# Altium schematic sheet Hvamp32_Supply.SchDoc: HVAMP_32
size 420 x 297 mm; EDA_Number: ARTIQ; Projet: Zotino; Author: G.Kasprowicz; CompanyName: WUT ISE; DrawnBy: G.Kasprowicz; Organization: WUT ISE; Address1: PW ISE; Address2: Nowowiejska 15/19 00-665 Warsaw; Address3: gkasprow@gmail.com; DocumentNumber: 3; Revision: 2; SheetNumber: 3; SheetTotal: 3; ModifiedBy: -; CheckedDate: -; Title2: Power Supply; DivGrp: WUT ISE; Designer: G.Kasprowicz; ModifiedDate: -; ProjectName: Sensor Box
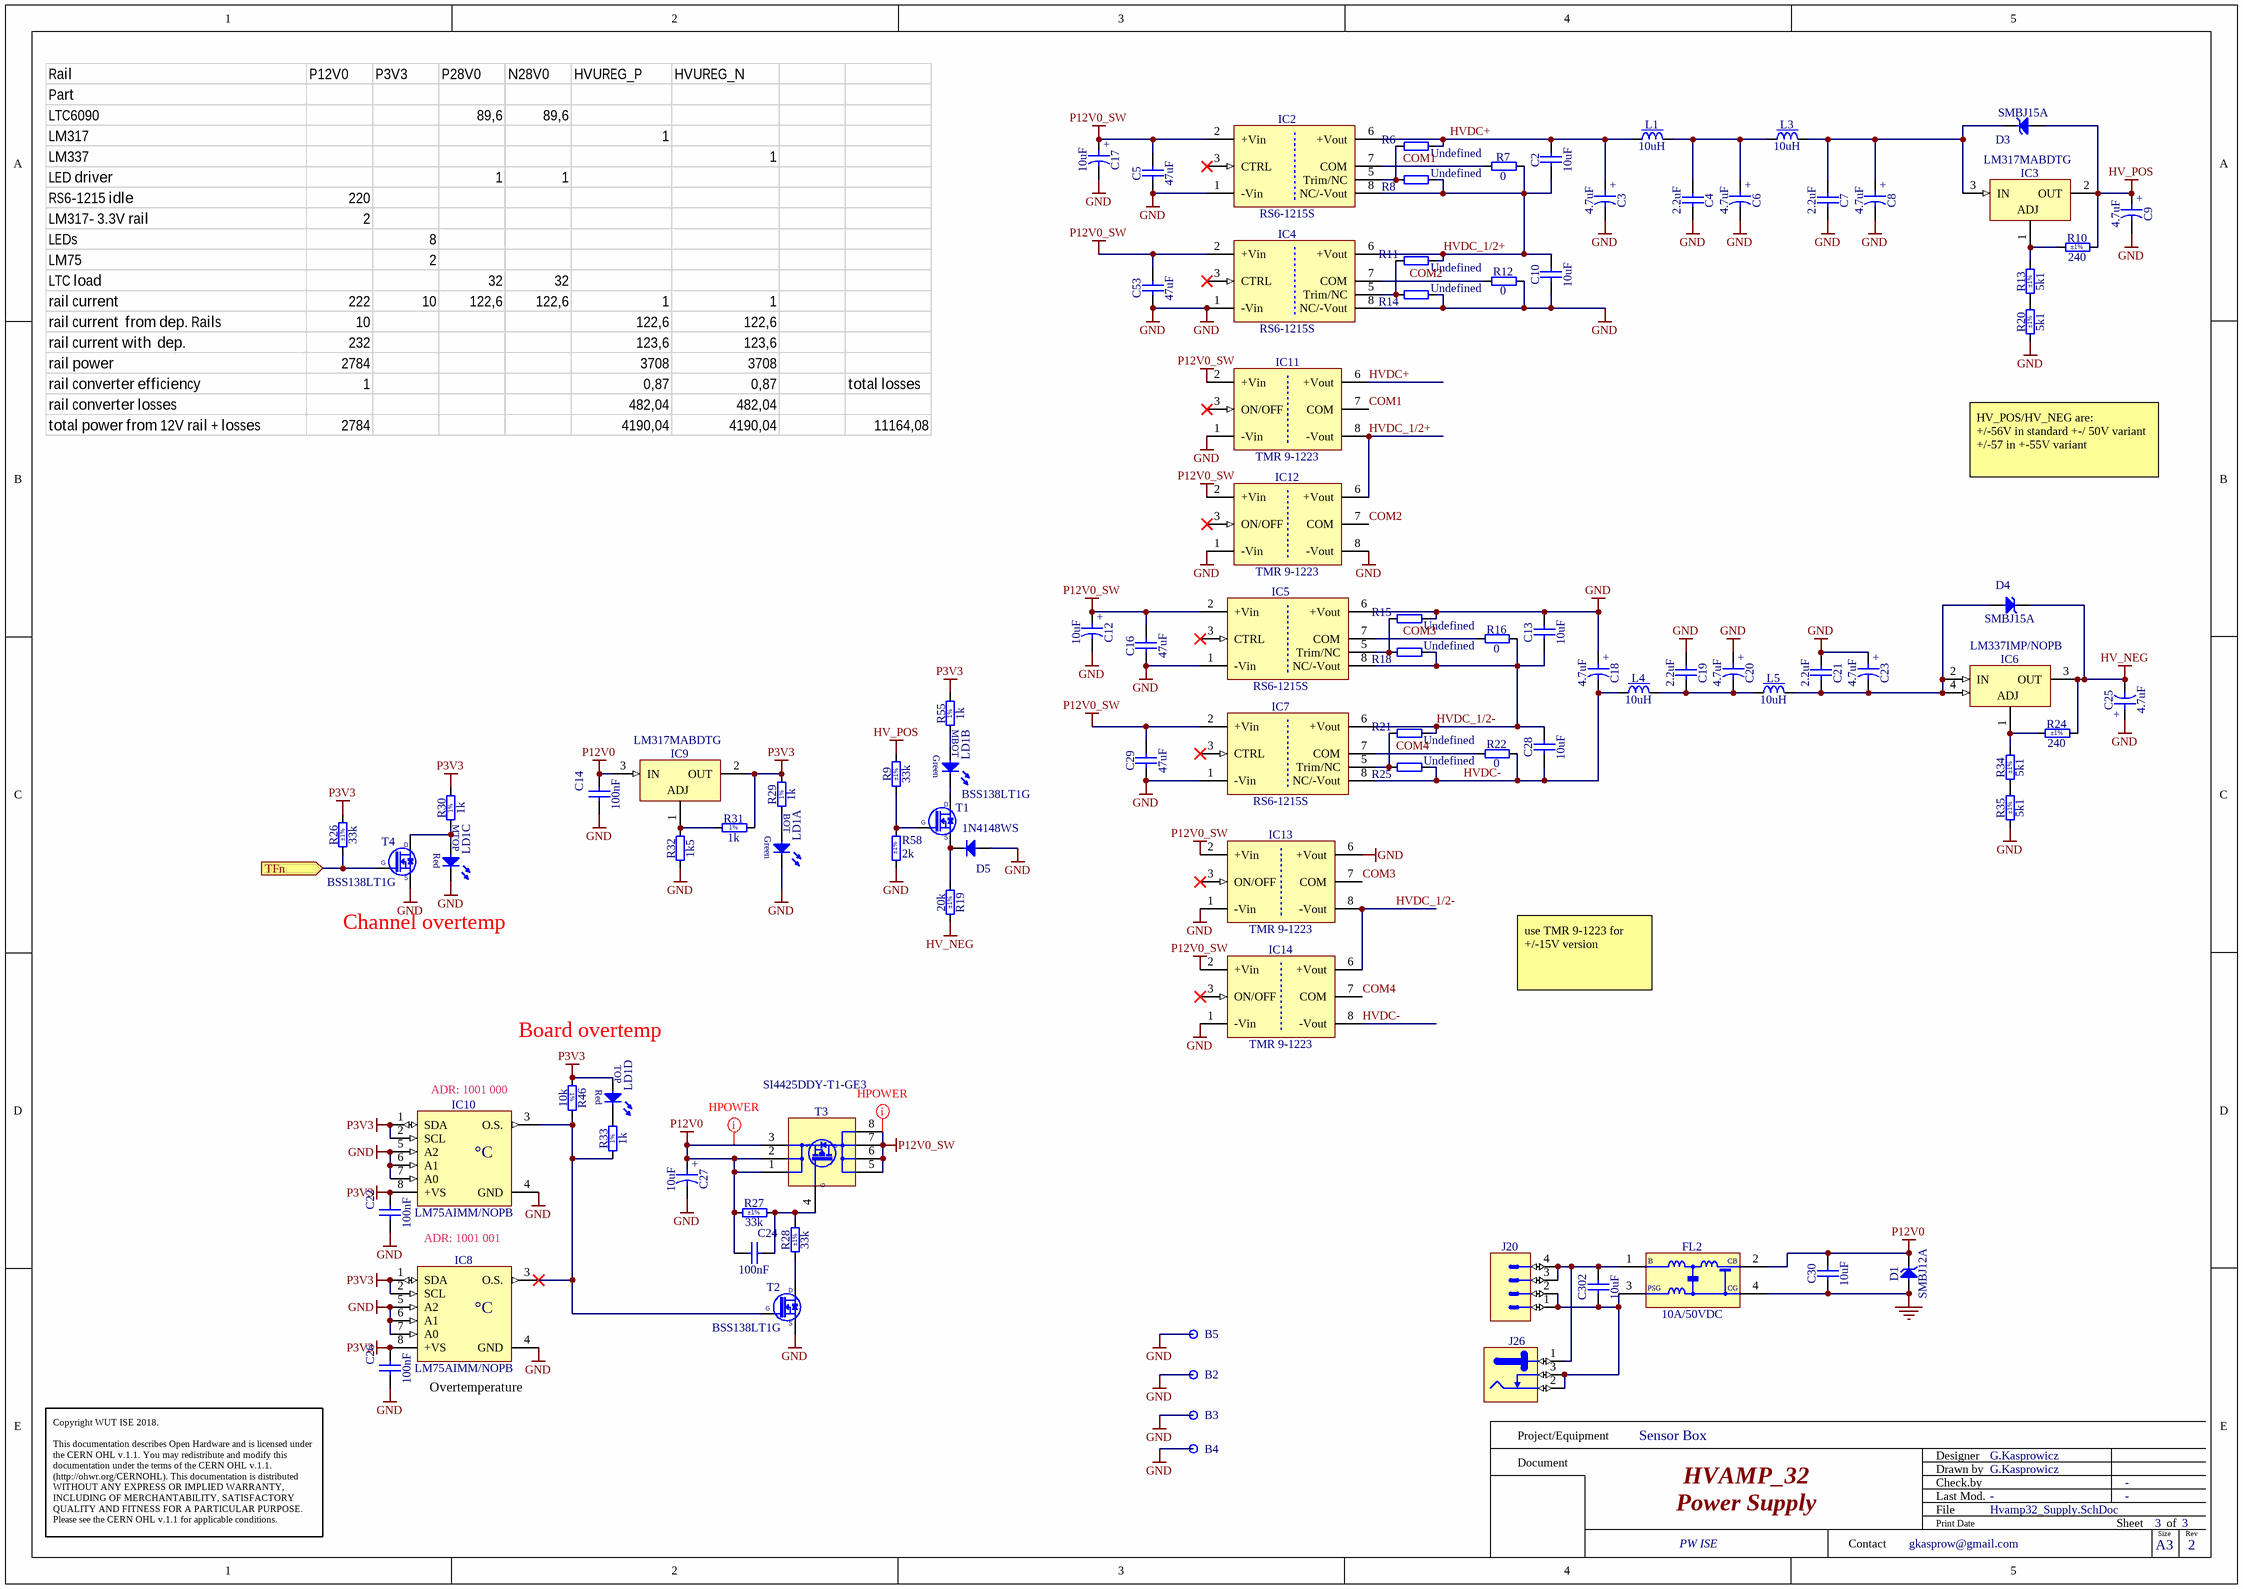
[diagram p0: Hvamp32_Supply.SchDoc]

## Parts
B2  Plated Hole  [MTG320_700]  (value not drawn)  (no BOM)
B3  Plated Hole  [MTG320_700]  (value not drawn)  (no BOM)
B4  Plated Hole  [MTG320_700]  (value not drawn)  (no BOM)
B5  Plated Hole  [MTG320_700]  (value not drawn)  (no BOM)
C2  10uF  [CAPC2012X145N]
C3  4.7uF  [CAPAE9383X100M]
C4  2.2uF  [CAPC3225X230N]
C5  47uF  [CAPC3225X270N]
C6  4.7uF  [CAPAE9383X100M]
C7  2.2uF  [CAPC3225X230N]
C8  4.7uF  [CAPAE9383X100M]
C9  4.7uF  [CAPAE9383X100M]
C10  10uF  [CAPC2012X145N]
C12  10uF  [CAPMP6032X280N]
C13  10uF  [CAPC2012X145N]
C14  100nF  [CAPC1608X90N]
C16  47uF  [CAPC3225X270N]
C17  10uF  [CAPMP6032X280N]
C18  4.7uF  [CAPAE9383X100M]
C19  2.2uF  [CAPC3225X230N]
C20  4.7uF  [CAPAE9383X100M]
C21  2.2uF  [CAPC3225X230N]
C22  100nF  [CAPC1608X90N]
C23  4.7uF  [CAPAE9383X100M]
C24  100nF  [CAPC1608X90N]
C25  4.7uF  [CAPAE9383X100M]
C26  100nF  [CAPC1608X90N]
C27  10uF  [CAPMP6032X280N]
C28  10uF  [CAPC2012X145N]
C29  47uF  [CAPC3225X270N]
C30  10uF  [CAPC2012X95N]
C53  47uF  [CAPC3225X270N]
C302  10uF  [CAPC2012X95N]
D1  SMBJ12A  [DIOM5336X265N]
D3  SMBJ15A  [DIOM5336X265N]
D4  SMBJ15A  [DIOM5336X265N]
D5  1N4148WS  [SODFL2512X100N]
FL2  10A/50VDC  [FIL_MURATA_BNX02]
IC2  RS6-1215S  [DCDC_RECOM_RS6]
IC3  LM317MABDTG  [DIODES-INC_TO-252-3L]
IC4  RS6-1215S  [DCDC_RECOM_RS6]
IC5  RS6-1215S  [DCDC_RECOM_RS6]
IC6  LM337IMP/NOPB  [SOT230P700X180-4N]
IC7  RS6-1215S  [DCDC_RECOM_RS6]
IC8  LM75AIMM/NOPB  [SOP65P490X109-8N]
IC9  LM317MABDTG  [DIODES-INC_TO-252-3L]
IC10  LM75AIMM/NOPB  [SOP65P490X109-8N]
IC11  TMR 9-1223  [DCDC_TRACO_TMR9WI]
IC12  TMR 9-1223  [DCDC_TRACO_TMR9WI]
IC13  TMR 9-1223  [DCDC_TRACO_TMR9WI]
IC14  TMR 9-1223  [DCDC_TRACO_TMR9WI]
J20  Mini-Fit Jr.™  [MOLEX_39-30-0040]  (value not drawn)
J26  Jack  [SWITCHCRAFT_712RA]  (value not drawn)
L1  10uH  [IND_MURATA-PS_8400]
L3  10uH  [IND_MURATA-PS_8400]
L4  10uH  [IND_MURATA-PS_8400]
L5  10uH  [IND_MURATA-PS_8400]
LD1  Green/Green/HeRed/HeRed  [LED_BIVAR_H485CHHGGDL]  (value not drawn)  (parts A,B,C,D of 4)
R6  Undefined  [RESC1608X55N]
R7  0  [RESC1608X55N]
R8  Undefined  [RESC1608X55N]
R9  33k  Tolerance: ±1%  [RESC1608X55N]
R10  240  Tolerance: ±1%  [RESC1608X55N]
R11  Undefined  [RESC1608X55N]
R12  0  [RESC1608X55N]
R13  5k1  Tolerance: ±1%  [RESC3216X65N]
R14  Undefined  [RESC1608X55N]
R15  Undefined  [RESC1608X55N]
R16  0  [RESC1608X55N]
R18  Undefined  [RESC1608X55N]
R19  20k  Tolerance: ±1%  [RESC1608X55N]
R20  5k1  Tolerance: ±1%  [RESC3216X65N]
R21  Undefined  [RESC1608X55N]
R22  0  [RESC1608X55N]
R24  240  Tolerance: ±1%  [RESC1608X55N]
R25  Undefined  [RESC1608X55N]
R26  33k  Tolerance: ±1%  [RESC1608X55N]
R27  33k  Tolerance: ±1%  [RESC1608X55N]
R28  33k  Tolerance: ±1%  [RESC1608X55N]
R29  1k  [RESC1005X40N]
R30  1k  [RESC1005X40N]
R31  1k  [RESC1005X40N]
R32  1k5  [RESC1005X40N]
R33  1k  [RESC1005X40N]
R34  5k1  Tolerance: ±1%  [RESC3216X65N]
R35  5k1  Tolerance: ±1%  [RESC3216X65N]
R46  10k  [RESC1005X40N]
R55  1k  [RESC1005X40N]
R58  2k  Tolerance: ±1%  [RESC1005X40N]
T1  BSS138LT1G  [SOT95P240X110-3N]
T2  BSS138LT1G  [SOT95P240X110-3N]
T3  SI4425DDY-T1-GE3  [SOIC127P600X175-8N]
T4  BSS138LT1G  [SOT95P240X110-3N]

## Ports
TFn (in)

## Nets
GND: B2.1 B3.1 B4.1 B5.1 C3.2 C4.2 C5.1 C6.2 C7.2 C8.2 C9.2 C10.1 C12.2 C13.2 C14.1 C16.1 C17.2 C18.1 C19.1 C20.1 C21.1 C22.1 C23.1 C25.1 C26.1 C27.2 C29.1 C30.1 C53.1 D1.2(A) D5.2(A) FL2.4(CG) IC2.1(-Vin) IC4.1(-Vin) IC4.8(NC/-Vout) IC5.1(-Vin) IC5.6(+Vout) IC7.1(-Vin) IC8.4(GND) IC8.5(A2) IC8.6(A1) IC8.7(A0) IC10.4(GND) IC10.5(A2) IC10.6(A1) IC10.7(A0) IC11.1(-Vin) IC12.1(-Vin) IC12.8(-Vout) IC13.1(-Vin) IC13.6(+Vout) IC14.1(-Vin) LD1.1(C) LD1.5(C) R12.2 R14.2 R15.2 R20.1 R32.1 R35.1 R58.1 T2.2(S) T4.2(S)
HV_NEG: C25.2 D4.1(C) IC6.3(OUT) R19.2 R24.2
HV_POS: C9.1 D3.2(A) IC3.2(OUT) R9.2 R10.2
P3V3: C22.2 C26.2 IC8.1(SDA) IC8.2(SCL) IC8.8(+VS) IC9.2(OUT) IC10.1(SDA) IC10.2(SCL) IC10.8(+VS) LD1.8(A) R26.2 R29.2 R30.2 R31.2 R46.1 R55.2
P12V0: C14.2 C24.1 C27.1 C30.2 D1.1(C) FL2.2(CB) IC9.3(IN) R27.1 T3.1(S) T3.2(S) T3.3(S)
P12V0_SW: C5.2 C12.1 C16.2 C17.1 C29.2 C53.2 IC2.2(+Vin) IC4.2(+Vin) IC5.2(+Vin) IC7.2(+Vin) IC11.2(+Vin) IC12.2(+Vin) IC13.2(+Vin) IC14.2(+Vin) T3.5(D) T3.6(D) T3.7(D) T3.8(D)
COM1: IC2.7(COM) IC11.7(COM) R7.1
COM2: IC4.7(COM) IC12.7(COM) R12.1
COM3: IC5.7(COM) IC13.7(COM) R16.1
COM4: IC7.7(COM) IC14.7(COM) R22.1
HVDC+: C2.2 C3.1 IC2.6(+Vout) IC11.6(+Vout) L1.1 R6.2
HVDC-: C18.2 C28.1 IC7.8(NC/-Vout) IC14.8(-Vout) L4.1 R22.2 R25.2
HVDC_1/2+: C2.1 C10.2 IC2.8(NC/-Vout) IC4.6(+Vout) IC11.8(-Vout) IC12.6(+Vout) R7.2 R8.2 R11.2
HVDC_1/2-: C13.1 C28.2 IC5.8(NC/-Vout) IC7.6(+Vout) IC13.8(-Vout) IC14.6(+Vout) R16.2 R18.2 R21.2
TFn: R26.1 T4.1(G) ; port TFn
NetC4_1: C4.1 C6.1 L1.2 L3.1
NetC7_1: C7.1 C8.1 D3.1(C) IC3.3(IN) L3.2
NetC19_2: C19.2 C20.2 L4.2 L5.1
NetC21_2: C21.2 C23.2 D4.2(A) IC6.2(IN) IC6.4(IN) L5.2
NetC24_2: C24.2 R27.2 R28.2 T3.4(S)
NetC302_1: C302.1 FL2.3(PSG) J20.1 J20.2 J26.2 J26.3
NetC302_2: C302.2 FL2.1(B) J20.3 J20.4 J26.1
NetD5_1: D5.1(C) R19.1 T1.2(S)
NetIC2_5: IC2.5(Trim/NC) R6.1 R8.1
NetIC3_1: IC3.1(ADJ) R10.1 R13.2
NetIC4_5: IC4.5(Trim/NC) R11.1 R14.1
NetIC5_5: IC5.5(Trim/NC) R15.1 R18.1
NetIC6_1: IC6.1(ADJ) R24.1 R34.2
NetIC7_5: IC7.5(Trim/NC) R21.1 R25.1
NetIC8_3: IC8.3(O.S.) IC10.3(O.S.) R33.1 R46.2 T2.1(G)
NetIC9_1: IC9.1(ADJ) R31.1 R32.2
NetLD1_2: LD1.2(A) R29.1
NetLD1_3: LD1.3(C) T1.3(D)
NetLD1_4: LD1.4(A) R55.1
NetLD1_6: LD1.6(A) R30.1 T4.3(D)
NetLD1_7: LD1.7(C) R33.2
NetR9_1: R9.1 R58.2 T1.1(G)
NetR13_1: R13.1 R20.2
NetR28_1: R28.1 T2.3(D)
NetR34_1: R34.1 R35.2

Not connected (* = marked no-connect by the designer): IC2 3(CTRL)*; IC4 3(CTRL)*; IC5 3(CTRL)*; IC7 3(CTRL)*; IC11 3(ON/OFF)*; IC12 3(ON/OFF)*; IC13 3(ON/OFF)*; IC14 3(ON/OFF)*

## Layout directives
net class Hpower: P12V0, P12V0_SW

## Notes on the sheet
- HV_POS/HV_NEG are:
  +/-56V in standard +-/ 50V variant
  +/-57 in +-55V variant
- Channel overtemp
- use TMR 9-1223 for +/-15V version
- Board overtemp
- (near IC10) ADR: 1001 000
- ADR: 1001 001
- Overtemperature
- Project/Equipment
- Document
- Designer
- Drawn by
- Check.by
- Copyright WUT ISE 2018.
  This documentation describes Open Hardware and is licensed under the CERN OHL v.1.1. You may redistribute and modify this documentation under the terms of the CERN OHL v.1.1. (http://ohwr.org/CERNOHL). This documentation is distributed WITHOUT ANY EXPRESS OR IMPLIED WARRANTY, INCLUDING OF MERCHANTABILITY, SATISFACTORY QUALITY AND FITNESS FOR A PARTICULAR PURPOSE. Please see the CERN OHL v.1.1 for applicable conditions.
- Contact
- File
- Last Mod.
- Print Date
- Sheet
- Size
- A3
- of
- Rev
- (in symbol CAP_ELECTRO_F_4.7u_250V) +
- (in symbol CTE6032-28_10UF_25V_10%_LESR0500) +
- (in symbol LED_BIVAR_H485CHHGGDL, part A) BOT; Green
- (in symbol LED_BIVAR_H485CHHGGDL, part B) MBOT; Green
- (in symbol LED_BIVAR_H485CHHGGDL, part C) MTOP; Red
- (in symbol LED_BIVAR_H485CHHGGDL, part D) TOP; Red
- (in symbol LM75AIMM/NOPB) °C
- (in symbol R0402_1k_1%_0.0625W_100PPM) 1%
- (in symbol R0402_10K_1%_0.0625W_100PPM) 1%
- (in symbol SI4425DDY-T1-GE3) G

## Library data of the parts
B2-B5 = PLATED_HOLE3.2_PAD7.0: Single Terminal Socket; Part Description: Plated Through Hole: Hole Dia.=3.2mm Pad Dia.=7.0mm; Mounted: No; Part Number: PLATED_HOLE3.2_PAD7.0; Component Type: Standard (No BOM); Pin Count: 1; Family: Plated Hole; Socket: No; SMD: No; Sense: No; Status: None; ComponentHeight: 0mm; HelpURL: Undefined; Author: CERN DEM JMW; CreateDate: 28.11.2017; LatestRevisionDate: 28.11.2017; PackageDescription: Plated Through Hole: Hole Dia.=3.2mm Pad Dia.=7.0mm
C2 C10 C13 C28 = CC0805_10UF_35V_10%_X5R_MURATA_GRM21BR6YA106KE43L: Non-polarised capacitor; Part Description: Chip Multilayer Ceramic Capacitor for General Purpose; Manufacturer: MURATA; Voltage: 35V; TC: X5R; Tolerance: ±10%; Part Number: CC0805_10UF_35V_10%_X5R_MURATA_GRM21BR6YA106KE43L; Component Kind: Standard; Component Type: Standard; Pin Count: 2; Value: 10uF; Status: Not Recommended; Manufacturer Part Number: GRM21BR6YA106KE43; Case: 0805; Mounted: Yes; Socket: No; SMD: Yes; Sense: No; ComponentHeight: 1.45mm; HelpURL: \\cern.ch\dfs\Applications\Altium\Datasheets\CC0805_MURATA_GRM21BR6YA106KE43L.pdf; Author: CERN DEM BC; CreateDate: 24.03.2020; LatestRevisionDate: 24.03.2020
C3 C6 C8 C9 C18 C20 C23 C25 = CAP_ELECTRO_F_4.7u_250V: Electrolytic capacitor 4.7uF 250V; Part Number: CAE800-1000_4.7UF_250V_20%; Part Description: Aluminum Electrolytic SMT Capacitor; Manufacturer: Nichicon; Manufacturer Part Number: UUX2E4R7MNL1GS; Tolerance: ±20%; Component Kind: Standard; Component Type: Standard; Pin Count: 2; Value: 4.7uF; Status: Recommended; Voltage: 250V; Case: F; Mounted: Yes; Socket: No; SMD: Yes; Sense: No; ComponentHeight: 10.2mm; HelpURL: \\cern.ch\dfs\Applications\Altium\Datasheets\CAE_PANASONIC_FK.pdf; Author: GK; CreateDate: 03.12.2007; LatestRevisionDate: 05.11.2014
C4 C7 C19 C21 = CC1210_2.2UF_100V_10%_X7R_MURATA_GCJ32DR72A225KA01L: Non-polarised capacitor; Part Description: Soft Termination SMD Chip Monolithic Ceramic Capacitor for Automotive; Manufacturer: MURATA; Voltage: 100V; TC: X7R; Tolerance: ±10%; Part Number: CC1210_2.2UF_100V_10%_X7R_MURATA_GCJ32DR72A225KA01L; Component Kind: Standard; Component Type: Standard; Pin Count: 2; Value: 2.2uF; Status: Not Recommended; Manufacturer Part Number: GCJ32DR72A225KA01L; Case: 1210; Mounted: Yes; Socket: No; SMD: Yes; Sense: No; ComponentHeight: 2.3mm; HelpURL: \\cern.ch\dfs\Applications\Altium\Datasheets\CC1210_MURATA_GCJ32DR72A225KA01L.pdf; Author: CERN DEM JLC; CreateDate: 10.05.2017; LatestRevisionDate: 10.05.2017
C5 C16 C29 C53 = CC1210_47UF_16V_20%_X5R: Non-polarised capacitor; Part Description: SMD Multilayer Chip Ceramic Capacitor; Manufacturer: GENERIC; Manufacturer1 Part Number: EMK325BJ476MM-T; Voltage: 16V; TC: X5R; Tolerance: ±20%; Part Number: CC1210_47UF_16V_20%_X5R; Component Kind: Standard; Component Type: Standard; Pin Count: 2; Value: 47uF; Status: None; Manufacturer Part Number: CC1210_47UF_16V_20%_X5R; Case: 1210; Mounted: Yes; Socket: No; SMD: Yes; Sense: No; Manufacturer1 Example: TAIYO YUDEN; Manufacturer1 ComponentHeight: 2.7mm; HelpURL: \\cern.ch\dfs\Applications\Altium\Datasheets\CC1210_X5R_TAIYO-YUDEN_HIGH-VALUE.pdf; Author: CERN DEM MR; CreateDate: 03.02.2016; LatestRevisionDate: 03.02.2016
C12 C17 C27 = CTE6032-28_10UF_25V_10%_LESR0500: Polarised capacitor; Part Description: Low ESR 0R5 Solid Tantalum Chip Capacitor; Manufacturer: GENERIC; Manufacturer1 Part Number: TPSC106K025R0500; Voltage: 25V; Tolerance: ±10%; Part Number: CTE6032-28_10UF_25V_10%_LESR0500; Component Kind: Standard; Component Type: Standard; Pin Count: 2; Value: 10uF; Status: Preferred; Manufacturer Part Number: CTE6032-28_10UF_25V_10%_LESR0500; Case: C; Mounted: Yes; Socket: No; SMD: Yes; Sense: No; Manufacturer1 Example: AVX; Manufacturer1 ComponentHeight: 2.8mm; HelpURL: \\cern.ch\dfs\Applications\Altium\Datasheets\CTE-LESR_AVX_TPS.pdf; Author: CERN DEM JLC; CreateDate: 05/05/2008; LatestRevisionDate: 20/01/2009
C14 C22 C24 C26 = CC0603_100NF_100V_10%_X7R: Non-polarised capacitor; Part Description: SMD Multilayer Chip Ceramic Capacitor; Manufacturer: GENERIC; Manufacturer1 Part Number: GRM188R72A104KA35D; Voltage: 100V; TC: X7R; Tolerance: ±10%; Part Number: CC0603_100NF_100V_10%_X7R; Component Kind: Standard; Component Type: Standard; Pin Count: 2; Value: 100nF; Status: None; Manufacturer Part Number: CC0603_100NF_100V_10%_X7R; Case: 0603; Mounted: Yes; Socket: No; SMD: Yes; Sense: No; Manufacturer1 Example: MURATA; Manufacturer1 ComponentHeight: 0.9mm; HelpURL: \\cern.ch\dfs\Applications\Altium\Datasheets\CC0603_MURATA_GRM188R72A104KA35D.pdf; Author: CERN DEM JLC; CreateDate: 11.12.2013; LatestRevisionDate: 11.12.2013
C30 C302 = CC0805_10UF_25V_10%_X5R: Non-polarised capacitor; Part Description: SMD Multilayer Chip Ceramic Capacitor; Manufacturer: GENERIC; Manufacturer1 Part Number: GRM219R61E106KA12D; Voltage: 25V; TC: X5R; Tolerance: ±10%; Part Number: CC0805_10UF_25V_10%_X5R; Component Kind: Standard; Component Type: Standard; Pin Count: 2; Value: 10uF; Status: Preferred; Manufacturer Part Number: CC0805_10UF_25V_10%_X5R; Case: 0805; Mounted: Yes; Socket: No; SMD: Yes; Sense: No; Manufacturer1 Example: MURATA; Manufacturer1 ComponentHeight: 0.95mm; HelpURL: \\cern.ch\dfs\Applications\Altium\Datasheets\CC0805_X5R_MURATA_GRM.pdf; Author: CERN DEM JLC; CreateDate: 25.10.2012; LatestRevisionDate: 06.09.2016
D1 = SMBJ12A: Zener Diode; Part Description: Uni-Directional Transient Voltage Suppressor Diode; Manufacturer: FAIRCHILD SEMICONDUCTOR; Voltage: 12V; Power: 600W; PressFit: No; Bonding: No; Part Number: SMBJ12A; Component Kind: Standard; Component Type: Standard; Device: SMBJ12A; PackageDescription: DO-214-AA/SMB Diode, Molded Body; 5.34mm L X 3.625mm W X 2.65mm H, IPC Medium Density; Manufacturer Part Number: SMBJ12A; Pin Count: 2; Case: DO-214AA; Mounted: Yes; Socket: No; SMD: Yes; Sense: No; ComponentHeight: 2.65mm; HelpURL: \\cern.ch\dfs\Applications\Altium\Datasheets\SMBJ.pdf; Author: CERN DEM JLC; CreateDate: 10.04.2013; LatestRevisionDate: 10.04.2013
D3 D4 = SMBJ15A: Zener Diode; Part Description: Uni-Directional Transient Voltage Suppressor Diode; Manufacturer: FAIRCHILD SEMICONDUCTOR; Voltage: 15V; Power: 600W; PressFit: No; Bonding: No; Part Number: SMBJ15A; Component Kind: Standard; Component Type: Standard; Device: SMBJ15A; PackageDescription: DO-214-AA/SMB Diode, Molded Body; 5.34mm L X 3.625mm W X 2.65mm H, IPC Medium Density; Manufacturer Part Number: SMBJ15A; Pin Count: 2; Case: DO-214AA; Mounted: Yes; Socket: No; SMD: Yes; Sense: No; ComponentHeight: 2.65mm; HelpURL: \\cern.ch\dfs\Applications\Altium\Datasheets\SMBJ.pdf; Author: CERN DEM JLC; CreateDate: 08.12.2008; LatestRevisionDate: 19.12.2011
D5 = 1N4148WS: Diode; Part Description: Small Signal Diodes; Manufacturer: FAIRCHILD SEMICONDUCTOR; Voltage: 75V; Power: 150mA; PressFit: No; Bonding: No; Part Number: 1N4148WS; Component Kind: Standard; Component Type: Standard; Device: 1N4148WS; PackageDescription: SODFL Diode (SOD323F); 1.70mm W X 1.25mm L X 1.00mm H body, IPC Medium Density; Manufacturer Part Number: 1N4148WS; Pin Count: 2; Case: SOD-323F; Mounted: Yes; Socket: No; SMD: Yes; Sense: No; ComponentHeight: 1mm; HelpURL: \\cern.ch\dfs\Applications\Altium\Datasheets\1N4148WS.pdf; Author: CERN DEM JLC; CreateDate: 12.05.2011; LatestRevisionDate: 12.05.2011
FL2 = FIL_MURATA_BNX022-01L: Block Type EMIFIL (LC Combined); Part Description: Block Type EMIFIL (LC Combined) SMD Type, BNX02* Series; Manufacturer: MURATA; Resistance: 0.5R; Part Number: FIL_MURATA_BNX022-01L; Component Kind: Standard; Component Type: Standard; Pin Count: 2; Value: 10A/50VDC; Status: None; Manufacturer Part Number: BNX022-01L; Mounted: Yes; Socket: No; SMD: Yes; Sense: No; ComponentHeight: 3.3mm; HelpURL: \\cern.ch\dfs\Applications\Altium\Datasheets\FIL_MURATA_BNX022-01L.pdf; Author: CERN DEM JLC; CreateDate: 10.10.2012; LatestRevisionDate: 10.10.2012
IC2 IC4 IC5 IC7 = DCDC_RS6-1215S: 12VDC to 15VDC, Iout 400mA, 2kVDC Isolated, 6W DC-DC Converter; Manufacturer: RECOM; PressFit: No; Bonding: No; Part Number: RS6-1215S; Component Kind: Standard; Component Type: Standard; Device: RS6-1215S; PackageDescription: RS6 Series, Body 21.8x9.2mm, Compact SIP-8 Package; Part Description: 12VDC to 15VDC, Iout 400mA, 2kVDC Isolated, 6W DC-DC Converter; Manufacturer Part Number: RS6-1215S; Pin Count: 7; Mounted: Yes; Socket: No; SMD: No; Sense: No; ComponentHeight: 11.6mm; HelpURL: \\cern.ch\dfs\Applications\Altium\Datasheets\RS6-2415D.pdf; Author: GK; CreateDate: 19.06.2017; LatestRevisionDate: 19.06.2017
IC3 IC9 = REG_LM317MABDTG: 1.2-37V 500mA Low Dropout Positive Regulator; Manufacturer: ONSEMI; PressFit: No; Bonding: No; Part Number: LM317MABDTG; Component Kind: Standard; Component Type: Standard; Device: LM317MABDTG; PackageDescription: TO-252 DPAK TO, 2.28mm Pitch; 2 Pin, 9.7mm L X 6.7mm W X 2.40mm H body; Part Description: 1.2-37V 500mA Low Dropout Positive Regulator; Manufacturer Part Number: LM317MABDTG; Pin Count: 3; Case: TO-252; Mounted: Yes; Socket: No; SMD: Yes; Sense: No; ComponentHeight: 2.4mm; HelpURL: \\cern.ch\dfs\Applications\Altium\Datasheets\AP1117D18G-13.pdf; Author: GK; CreateDate: 03.10.2012; LatestRevisionDate: 03.10.2012
IC6 = LM337IMP/NOPB: 3-Terminal Regulator 1=Adj 2=IN 3=OUT 4=IN; Part Description: 3-Terminal -1.2V To -37V 1A Adjustable Negative Regulator; Manufacturer: TEXAS INSTRUMENTS; PressFit: No; Bonding: No; Part Number: LM337IMP/NOPB; Component Kind: Standard; Component Type: Standard; Device: LM337IMP/NOPB; PackageDescription: SOT223, 2.30mm Pitch; 4 Pin, 3.70mm W X 6.70mm L X 1.80mm H body, IPC Medium Density; Manufacturer Part Number: LM337IMP/NOPB; Pin Count: 4; Case: SOT223; Mounted: Yes; Socket: No; SMD: Yes; Sense: No; ComponentHeight: 1.8mm; HelpURL: \\cern.ch\dfs\Applications\Altium\Datasheets\LM337IMP-NOPB.pdf; Author: CERN DEM JLC; CreateDate: 31.08.2010; LatestRevisionDate: 21.09.2015
IC8 IC10 = LM75AIMM/NOPB: Digital Temperature Sensor and Thermal Watchdog with Two-Wire Interface; Part Description: -25° to +100°C ±2°C Digital Temperature Sensor and Thermal Watchdog with Two-Wire Interface; Manufacturer: TEXAS INSTRUMENTS; PressFit: No; Bonding: No; Part Number: LM75AIMM/NOPB; Component Kind: Standard; Component Type: Standard; Device: LM75AIMM/NOPB; PackageDescription: SOP, 0.65mm pitch; 8 pin,3.00mm W X 3.00mm L X 1.09mm H bodyI, PC Medium Density; Manufacturer Part Number: LM75AIMM/NOPB; Pin Count: 8; Case: SSOP8; Mounted: Yes; Socket: No; SMD: Yes; Sense: No; ComponentHeight: 1.09mm; HelpURL: \\cern.ch\dfs\Applications\Altium\Datasheets\LM75AIMM-NOPB.pdf; Author: CERN DEM JLC; CreateDate: 15.10.2012; LatestRevisionDate: 15.10.2012
IC11-IC14 = DCDC_TRACO_TMR 9-1223: TRACO, TMR 9 WI Series, Dual Output DCDC Converter; Part Description: 9-18VDC to ±15VDC, Iout (max) ±300mA, 9W DC-DC Converter; Manufacturer: TRACO POWER; PressFit: No; Bonding: No; Part Number: TMR 9-1223; Component Kind: Standard; Component Type: Standard; Device: TMR 9-1223; PackageDescription: TMR 9 WI Series, Body 21.8x9.6mm, Compact SIP-8 Package; Manufacturer Part Number: TMR 9-1223; Pin Count: 6; Mounted: Yes; Socket: No; SMD: No; Sense: No; ComponentHeight: 11.7mm; HelpURL: \\cern.ch\dfs\Applications\Altium\Datasheets\TMR 9-4822WI.pdf; Author: GK; CreateDate: 11.07.2017; LatestRevisionDate: 11.07.2017
J20 = MOLEX_39-30-0040: Connector 4 Male; Part Description: 4.20mm (.165") Pitch Mini-Fit Jr. Header, Dual Row, Right Angle with Snap-in Plastic Peg PCB Lock, 4 Circuits; Manufacturer: MOLEX; PressFit: No; Part Number: MOLEX_39-30-0040; Component Kind: Standard; Component Type: Standard; Pin Count: 4; Family: Mini-Fit Jr.™; Mounted: Yes; Socket: No; SMD: No; Sense: No; Status: None; Manufacturer Part Number: 39-30-0040; ComponentHeight: 11.4mm; HelpURL: \\cern.ch\dfs\Applications\Altium\Datasheets\MOLEX_39-30-0040.pdf; Author: CERN DEM JLC; CreateDate: 2018-10-02; LatestRevisionDate: 2018-10-02
J26 = SWITCHCRAFT_712RA: 2.5 mm Center Pin, 5A, 48V, Right Angle, Through Hole, , DC Power Jack Connector; Part Description: 2.5 mm Center Pin, 5A, 48VDC, Right Angle, Through Hole, Locking Power Jack Connector (Threaded Bushings); Manufacturer Part Number: 712RA; PressFit: No; Part Number: SWITCHCRAFT_712RA; Component Kind: Standard; Component Type: Standard; Pin Count: 3; Family: Jack; Mounted: Yes; Socket: No; SMD: No; Sense: No; Status: None; Manufacturer: SWITCHCRAFT; ComponentHeight: 13.8mm; HelpURL: \\cern.ch\dfs\Applications\Altium\Datasheets\SWITCHCRAFT_712RA.pdf; Author: CERN DEM JLC; CreateDate: 2017-12-19; LatestRevisionDate: 2017-12-19
L1 L3-L5 = IND_10UH_10%_MURATA-PS_8400: Inductor With Core; Part Description: Miniature Surface Mount Power Inductor (8400 Serie); Manufacturer: MURATA POWER SOLUTIONS; Manufacturer Part Number: 84103C; Power: 950mA; Resistance: 0.24R; Tolerance: ±10%; Part Number: IND_10UH_10%_MURATA-PS_8400; Component Kind: Standard; Component Type: Standard; Pin Count: 2; Value: 10uH; Status: None; Mounted: Yes; Socket: No; SMD: Yes; Sense: No; ComponentHeight: 2.9mm; HelpURL: \\cern.ch\dfs\Applications\Altium\Datasheets\IND_MURATA-PS_8400.pdf; Author: CERN DEM JLC; CreateDate: 02.07.2012; LatestRevisionDate: 02.07.2012
LD1 = LED_BIVAR_H485CHHGGDL: LED x4 G-1C2A-BOT_G-3C4A_H-5C6A_H-7C8A-TOP; Part Description: Quad-Level 2mm (Green+Green+HeRed+HeRed) LED, PCB Edge Mounting; Manufacturer: BIVAR; PressFit: No; Bonding: No; Part Number: LED_BIVAR_H485CHHGGDL; Component Kind: Standard; Component Type: Standard; Color: Green/Green/HeRed/HeRed; PackageDescription: Quad-Level 2mm (Green+Green+HeRed+HeRed) LED, PCB Edge Mounting  BIVAR H485C Serie; Status: Not Recommended; Manufacturer Part Number: H485CHHGGDL; Pin Count: 8; Mounted: Yes; Socket: No; SMD: No; Sense: No; ComponentHeight: 11.3mm; HelpURL: \\cern.ch\dfs\Applications\Altium\Datasheets\LED_BIVAR_H485C.pdf; Author: CERN DEM BC; CreateDate: 12/11/2015; LatestRevisionDate: 12/11/2015
R6 R8 R11 R14 R15 R18 R21 R25 = R0603_NO-VALUE: Resistor; Part Description: Reserved Footprint For a 0603 (1608) Chip Resistor; PressFit: No; Mounted: No; Part Number: R0603_NO-VALUE; Component Kind: Standard; Component Type: Standard; Pin Count: 2; Value: Undefined; Status: None; Manufacturer: Undefined; Manufacturer Part Number: R0603_NO-VALUE; Case: 0603; Sense: No; Socket: No; SMD: Yes; Manufacturer1 Example: Undefined; Manufacturer1 Part Number: Undefined; Manufacturer1 ComponentHeight: Undefined; HelpURL: Undefined; Author: CERN DEM JLC; CreateDate: 03.12.2007; LatestRevisionDate: 13.03.2008
R7 R12 R16 R22 = R0603_0R_JUMPER: Resistor; Part Description: 1A (0.05R Max DC Resistance) Zero Ohm Jumper; Manufacturer: GENERIC; Manufacturer1 Part Number: NRC06Z0; PressFit: No; Part Number: R0603_0R_JUMPER; Component Kind: Standard; Component Type: Standard; Pin Count: 2; Value: 0; Status: Preferred; Manufacturer Part Number: R0603_0R_JUMPER; Case: 0603; Mounted: Yes; Sense: No; Socket: No; SMD: Yes; Manufacturer1 Example: NIC COMPONENT; Manufacturer1 ComponentHeight: 0.55mm; HelpURL: \\cern.ch\dfs\Applications\Altium\Datasheets\R0603_NIC_NRC.pdf; Author: CERN DEM JLC; CreateDate: 03.12.2007; LatestRevisionDate: 13.03.2008
R9 R26-R28 = R0603_33K_1%_0.1W_100PPM: Resistor - 1%; Part Description: General Purpose Thick Film Chip Resistor; Manufacturer: GENERIC; Manufacturer1 Part Number: NRC06F3302TRF; Power: 0.1W; TC: ±100ppm/°C; PressFit: No; Part Number: R0603_33K_1%_0.1W_100PPM; Component Kind: Standard; Component Type: Standard; Pin Count: 2; Value: 33k; Status: Preferred; Manufacturer Part Number: R0603_33K_1%_0.1W_100PPM; Case: 0603; Mounted: Yes; Sense: No; Socket: No; SMD: Yes; Manufacturer1 Example: NIC COMPONENT; Manufacturer1 ComponentHeight: 0.55mm; HelpURL: \\cern.ch\dfs\Applications\Altium\Datasheets\R0603_NIC_NRC.pdf; Author: CERN DEM JLC; CreateDate: 03.12.2007; LatestRevisionDate: 13.03.2008
R10 R24 = R0603_240R_1%_0.1W_100PPM: Resistor - 1%; Part Description: General Purpose Thick Film Chip Resistor; Manufacturer: GENERIC; Manufacturer1 Part Number: NRC06F2400TRF; Power: 0.1W; TC: ±100ppm/°C; PressFit: No; Part Number: R0603_240R_1%_0.1W_100PPM; Component Kind: Standard; Component Type: Standard; Pin Count: 2; Value: 240; Status: Preferred; Manufacturer Part Number: R0603_240R_1%_0.1W_100PPM; Case: 0603; Mounted: Yes; Sense: No; Socket: No; SMD: Yes; Manufacturer1 Example: NIC COMPONENT; Manufacturer1 ComponentHeight: 0.55mm; HelpURL: \\cern.ch\dfs\Applications\Altium\Datasheets\R0603_NIC_NRC.pdf; Author: CERN DEM JLC; CreateDate: 03.12.2007; LatestRevisionDate: 13.03.2008
R13 R20 R34 R35 = R1206_5K1_1%_0.25W_100PPM: Resistor - 1%; Part Description: General Purpose Thick Film Chip Resistor; Manufacturer: GENERIC; Manufacturer1 Part Number: NRC12F5101TRF; Power: 0.25W; TC: ±100ppm/°C; PressFit: No; Part Number: R1206_5K1_1%_0.25W_100PPM; Component Kind: Standard; Component Type: Standard; Pin Count: 2; Value: 5k1; Status: Preferred; Manufacturer Part Number: R1206_5K1_1%_0.25W_100PPM; Case: 1206; Mounted: Yes; Sense: No; Socket: No; SMD: Yes; Manufacturer1 Example: NIC COMPONENT; Manufacturer1 ComponentHeight: 0.65mm; HelpURL: \\cern.ch\dfs\Applications\Altium\Datasheets\R1206_NIC_NRC.pdf; Author: CERN DEM JLC; CreateDate: 03.12.2007; LatestRevisionDate: 13.03.2008
R19 = R0603_20K_1%_0.1W_100PPM: Resistor - 1%; Part Description: General Purpose Thick Film Chip Resistor; Manufacturer: GENERIC; Manufacturer1 Part Number: NRC06F2002TRF; Power: 0.1W; TC: ±100ppm/°C; PressFit: No; Part Number: R0603_20K_1%_0.1W_100PPM; Component Kind: Standard; Component Type: Standard; Pin Count: 2; Value: 20k; Status: Preferred; Manufacturer Part Number: R0603_20K_1%_0.1W_100PPM; Case: 0603; Mounted: Yes; Sense: No; Socket: No; SMD: Yes; Manufacturer1 Example: NIC COMPONENT; Manufacturer1 ComponentHeight: 0.55mm; HelpURL: \\cern.ch\dfs\Applications\Altium\Datasheets\R0603_NIC_NRC.pdf; Author: CERN DEM JLC; CreateDate: 03.12.2007; LatestRevisionDate: 13.03.2008
R29-R31 R33 R55 = R0402_1k_1%_0.0625W_100PPM: Resistor - 1%; Part Description: General Purpose Thick Film Chip Resistor; Manufacturer: GENERIC; Manufacturer1 Part Number: 232270671002L; TC: ±100ppm/°C; PressFit: No; Part Number: R0402_1K_1%_0.0625W_100PPM; Component Kind: Standard; Component Type: Standard; Pin Count: 2; Value: 1k; Status: Not Recommended; Power: 0.0625W; Tolerance: ±1%; Manufacturer Part Number: R0402_1K_1%_0.0625W_100PPM; Case: 0402; Mounted: Yes; Sense: No; Socket: No; SMD: Yes; Manufacturer1 Example: YAGEO PHYCOMP; Manufacturer1 ComponentHeight: 0.4mm; HelpURL: \\cern.ch\dfs\Applications\Altium\Datasheets\R0402_Phycomp_RC0402.pdf; Author: CERN DEM JLC; CreateDate: 03.12.2007; LatestRevisionDate: 17.10.2012; ClassName: Artix
R32 = R0402_1k5_1%_0.0625W_100PPM: Resistor - 1%; Part Description: General Purpose Thick Film Chip Resistor; Manufacturer: GENERIC; Manufacturer1 Part Number: 232270671502L; TC: ±100ppm/°C; PressFit: No; Part Number: R0402_1K5_1%_0.0625W_100PPM; Component Kind: Standard; Component Type: Standard; Pin Count: 2; Value: 1k5; Status: Not Recommended; Power: 0.0625W; Tolerance: ±1%; Manufacturer Part Number: R0402_1K5_1%_0.0625W_100PPM; Case: 0402; Mounted: Yes; Sense: No; Socket: No; SMD: Yes; Manufacturer1 Example: YAGEO PHYCOMP; Manufacturer1 ComponentHeight: 0.4mm; HelpURL: \\cern.ch\dfs\Applications\Altium\Datasheets\R0402_Phycomp_RC0402.pdf; Author: CERN DEM JLC; CreateDate: 03.12.2007; LatestRevisionDate: 17.10.2012
R46 = R0402_10K_1%_0.0625W_100PPM: Resistor - 1%; Part Description: General Purpose Thick Film Chip Resistor; Manufacturer: GENERIC; Manufacturer1 Part Number: 232270671003L; TC: ±100ppm/°C; PressFit: No; Part Number: R0402_10K_1%_0.0625W_100PPM; Component Kind: Standard; Component Type: Standard; Pin Count: 2; Value: 10k; Status: Not Recommended; Power: 0.0625W; Tolerance: ±1%; Manufacturer Part Number: R0402_10K_1%_0.0625W_100PPM; Case: 0402; Mounted: Yes; Sense: No; Socket: No; SMD: Yes; Manufacturer1 Example: YAGEO PHYCOMP; Manufacturer1 ComponentHeight: 0.4mm; HelpURL: \\cern.ch\dfs\Applications\Altium\Datasheets\R0402_Phycomp_RC0402.pdf; Author: CERN DEM JLC; CreateDate: 03.12.2007; LatestRevisionDate: 17.10.2012
R58 = R0402_2K_1%_0.0625W_100PPM: Resistor - 1%; Part Description: General Purpose Thick Film Chip Resistor; Manufacturer: GENERIC; Manufacturer1 Part Number: 232270672002L; TC: ±100ppm/°C; PressFit: No; Part Number: R0402_2K_1%_0.0625W_100PPM; Component Kind: Standard; Component Type: Standard; Pin Count: 2; Value: 2k; Status: Not Recommended; Power: 0.0625W; Manufacturer Part Number: R0402_2K_1%_0.0625W_100PPM; Case: 0402; Mounted: Yes; Sense: No; Socket: No; SMD: Yes; Manufacturer1 Example: YAGEO PHYCOMP; Manufacturer1 ComponentHeight: 0.4mm; HelpURL: \\cern.ch\dfs\Applications\Altium\Datasheets\R0402_Phycomp_RC0402.pdf; Author: CERN DEM JLC; CreateDate: 03.12.2007; LatestRevisionDate: 17.10.2012
T1 T2 T4 = BSS138LT1G: N-CHANNEL MOSFET WITH DIODE; Part Description: 50V, 200mA N-Channel Enhancement Mode Field-Effect Transistor; Manufacturer: ON SEMICONDUCTOR; PressFit: No; Bonding: No; Part Number: BSS138LT1G; Component Kind: Standard; Component Type: Standard; Device: BSS138LT1G; PackageDescription: SOT23, 0.95mm Pitch; 3 Pin, 1.40mm W X 3.00mm L X 1.10mm H body, IPC Medium Density; Manufacturer Part Number: BSS138LT1G; Pin Count: 3; Case: SOT23-3; Mounted: Yes; Socket: No; SMD: Yes; Sense: No; ComponentHeight: 1.11mm; HelpURL: \\cern.ch\dfs\Applications\Altium\Datasheets\BSS138LT1G.pdf; Author: CERN DEM JLC; CreateDate: 23.03.2009; LatestRevisionDate: 23.03.2009
T3 = SI4425DDY-T1-GE3: -30V -19.7A P-Channel MOSFET; Manufacturer: VISHAY SILICONIX; PressFit: No; Bonding: No; Part Number: SI4425DDY-T1-GE3; Component Kind: Standard; Component Type: Standard; Device: SI4425DDY-T1-GE3; PackageDescription: SOIC 8, Pitch 1.27mm - Body 4x5mm, IPC Medium Density; Part Description: -30V -19.7A P-Channel MOSFET; Manufacturer Part Number: SI4425DDY-T1-GE3; Pin Count: 8; Case: SOIC8; Mounted: Yes; Socket: No; SMD: Yes; Sense: No; ComponentHeight: 1.75mm; HelpURL: \\cern.ch\dfs\Applications\Altium\Datasheets\SI4425DDY-T1-GE3.pdf; Author: CERN DEM MR; CreateDate: 05/10/2016; LatestRevisionDate: 05/10/2016